# Altium schematic sheet PT2272.SchDoc
size A4
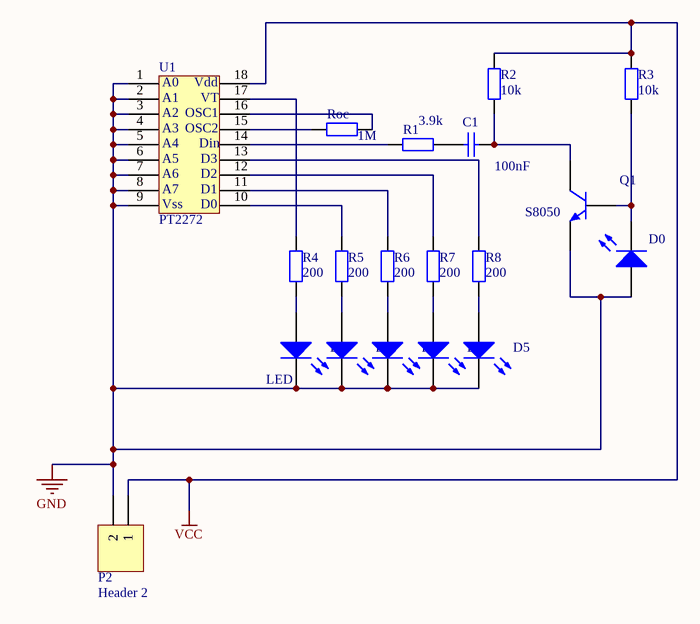
[diagram p0: PT2272.SchDoc]

## Parts
C1  value 100nF  [CAP0.2]  (hidden comment: Cap)
D0  (no value)  [LEDLXH-3]
D1  LED  [LEDLXH-3]
D2  (no value)  [LEDLXH-3]
D3  (no value)  [LEDLXH-3]
D4  (no value)  [LEDLXH-3]
D5  (no value)  [LEDLXH-3]
P2  Header 2  [POWER PLUG2]
Q1  S8050  [NPN-2]
R1  value 3.9k  [AXIAL-0.4]  (hidden comment: Res2)
R2  value 10k  [AXIAL-0.4]  (hidden comment: Res2)
R3  value 10k  [AXIAL-0.4]  (hidden comment: Res2)
R4  value 200  [AXIAL-0.4]  (hidden comment: Res2)
R5  value 200  [AXIAL-0.4]  (hidden comment: Res2)
R6  value 200  [AXIAL-0.4]  (hidden comment: Res2)
R7  value 200  [AXIAL-0.4]  (hidden comment: Res2)
R8  value 200  [AXIAL-0.4]  (hidden comment: Res2)
Roc  value 1M  [AXIAL-0.4]  (hidden comment: Res2)
U1  PT2272  [DIP-18]

## Nets
GND: D0.1(A) D1.2(K) D2.2(K) D3.2(K) D4.2(K) D5.2(K) P2.2 Q1.1(E) U1.1 U1.2 U1.3 U1.4 U1.5 U1.6 U1.7 U1.8 U1.9
VCC: P2.1 R2.2 R3.2 U1.18
NetC1_1: C1.1 R1.2
NetC1_2: C1.2 Q1.3(C) R2.1
NetD0_2: D0.2(K) Q1.2(B) R3.1
NetD1_1: D1.1(A) R4.1
NetD2_1: D2.1(A) R5.1
NetD3_1: D3.1(A) R6.1
NetD4_1: D4.1(A) R7.1
NetD5_1: D5.1(A) R8.1
NetR1_1: R1.1 U1.14
NetR4_2: R4.2 U1.17
NetR5_2: R5.2 U1.10
NetR6_2: R6.2 U1.11
NetR7_2: R7.2 U1.12
NetR8_2: R8.2 U1.13
NetRoc_1: Roc.1 U1.15
NetRoc_2: Roc.2 U1.16

## Notes on the sheet
- (in symbol PT2272) A0; Vdd; A1; VT; A2; OSC1; A3; OSC2; A4; Din; A5; D3; A6; D2; A7; D1; Vss; D0

## Library data of the parts
C1 = Cap: Capacitor; Published: 8-Jun-2000; LatestRevisionDate: 17-Jul-2002; LatestRevisionNote: Re-released for DXP Platform.; PackageReference: RAD-0.3; Publisher: Altium Limited
D0-D5 = LED0: Typical INFRARED GaAs LED; Published: 8-Jun-2000; LatestRevisionDate: 08-Jul-2005; LatestRevisionNote: Mech Layer 1 removed.; PackageReference: LED-0; Publisher: Altium Limited
P2 = Header 2: Header, 2-Pin; LatestRevisionDate: 17-Jul-2002; LatestRevisionNote: Re-released for DXP Platform.; Publisher: Altium Limited
Q1 = 2N3904: NPN General Purpose Amplifier; Published: 8-Jun-2000; LatestRevisionDate: 15-Jan-2003; LatestRevisionNote: PCB Footprint 'BCY-W3/D4.7' replaced; DatasheetDocument: 1997; PackageDocument: Sep-1998; PackageReference: TO-92A; Publisher: Altium Limited; Code_JEDEC: TO-92A; ComponentLink1Description: Manufacturer Link; ComponentLink1URL: http://www.fairchildsemi.com/; ComponentLink2Description: Datasheet; ComponentLink2URL: http://www.fairchildsemi.com/ds/2N%2F2N3904.pdf
R1-R8 Roc = Res2: Resistor; Published: 8-Jun-2000; LatestRevisionDate: 17-Jul-2002; LatestRevisionNote: Re-released for DXP Platform.; PackageReference: AXIAL-0.4; Publisher: Altium Limited